# EAGLE design Hip Bass Drum (EAGLE 7.1.0)
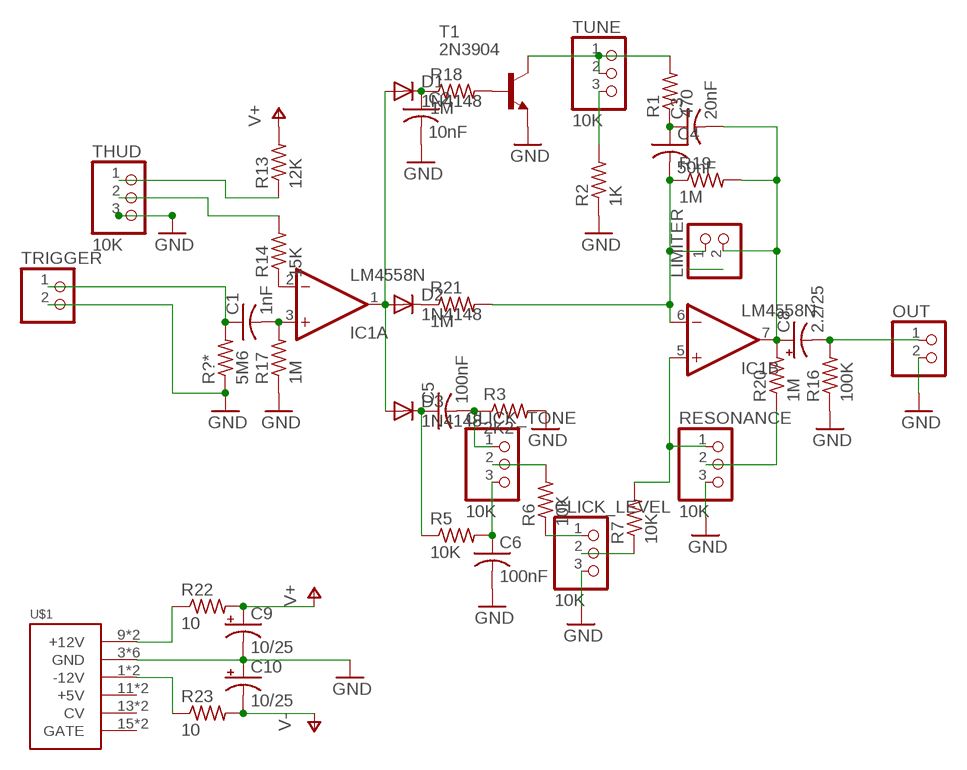
[diagram p0: schematic, sheet 1]

## Parts
C1  1nF  C-US025-030X050  [C025-030X050]
C2  10nF  C-US025-030X050  [C025-030X050]
C3  20nF  C-US025-030X050  [C025-030X050]
C4  50nF  C-US025-030X050  [C025-030X050]
C5  100nF  C-US025-030X050  [C025-030X050]
C6  100nF  C-US025-030X050  [C025-030X050]
C8  2.2/25  CPOL-USE2.5-7  [E2,5-7]
C9  10/25  CPOL-USE2.5-7  [E2,5-7]
C10  10/25  CPOL-USE2.5-7  [E2,5-7]
CLICK_LEVEL  10K  PINHD-1X3  [1X03]
CLICK_TONE  10K  PINHD-1X3  [1X03]
D1  1N4148  [DO35-10]
D2  1N4148  [DO35-10]
D3  1N4148  [DO35-10]
IC1  LM4558N  [DIL08]
LIMITER  PINHD-1X2  [1X02]
OUT  PINHD-1X2  [1X02]
R1  470  R-US_0207/10  [0207/10]
R2  1K  R-US_0207/10  [0207/10]
R3  2K2  R-US_0207/10  [0207/10]
R5  10K  R-US_0207/10  [0207/10]
R6  10K  R-US_0207/10  [0207/10]
R7  10K  R-US_0207/10  [0207/10]
R13  12K  R-US_0207/10  [0207/10]
R14  15K  R-US_0207/10  [0207/10]
R16  100K  R-US_0207/10  [0207/10]
R17  1M  R-US_0207/10  [0207/10]
R18  1M  R-US_0207/10  [0207/10]
R19  1M  R-US_0207/10  [0207/10]
R20  1M  R-US_0207/10  [0207/10]
R21  1M  R-US_0207/10  [0207/10]
R22  10  R-US_0207/10  [0207/10]
R23  10  R-US_0207/10  [0207/10]
R?*  5M6  R-US_0207/10  [0207/10]
RESONANCE  10K  PINHD-1X3  [1X03]
T1  2N3904  [TO92]
THUD  10K  PINHD-1X3  [1X03]
TRIGGER  PINHD-1X2  [1X02]
TUNE  10K  PINHD-1X3  [1X03]
U$1  POWER  [POWER_16]

## Nets
GND: C2.2 C6.2 C9.- C10.+ CLICK_LEVEL.3 OUT.2 R2.1 R3.2 R16.1 R17.1 R?*.1 RESONANCE.3 T1.3(E) THUD.3 TRIGGER.2 U$1.3(GND) U$1.4(GND) U$1.5(GND) U$1.6(GND) U$1.7(GND) U$1.8(GND)
N$1: C1.2 IC1.3(A:+IN) R17.2
N$2: C1.1 R?*.2 TRIGGER.1
N$3: IC1.2(A:-IN) R14.1
N$4: R22.1 U$1.9(+12V) U$1.10(+12V)
N$5: R23.1 U$1.1(-12V) U$1.2(-12V)
N$6: R13.1 THUD.1
N$7: R14.2 THUD.2
N$8: C2.1 D1.C R18.1
N$9: R18.2 T1.2(B)
N$10: D1.A D2.A D3.A IC1.1(A:OUT)
N$11: R1.2 T1.1(C) TUNE.1 TUNE.2
N$12: R2.2 TUNE.3
N$13: C3.1 C4.1 R1.1
N$14: C4.2 IC1.6(B:-IN) LIMITER.1 R19.1 R21.2
N$15: C3.2 C8.+ IC1.7(B:OUT) LIMITER.2 R19.2 R20.2
N$16: D2.C R21.1
N$17: C8.- OUT.1 R16.2
N$18: IC1.5(B:+IN) R7.2 RESONANCE.1
N$19: R20.1 RESONANCE.2
N$20: C5.1 D3.C R5.1
N$21: C6.1 CLICK_TONE.3 R5.2
N$22: C5.2 CLICK_TONE.1 R3.1
N$23: CLICK_TONE.2 R6.2
N$24: CLICK_LEVEL.1 R6.1
N$25: CLICK_LEVEL.2 R7.1
V+: C9.+ R13.2 R22.2
V-: C10.- R23.2
Unconnected: U$1.11(+5V) U$1.12(+5V) U$1.13(CV) U$1.14(CV) U$1.15(GATE) U$1.16(GATE)

## Power pins joined to a net without a drawn wire
V+: IC1.8(P:V+)
V-: IC1.4(P:V-)

## Library data of the parts
C1-C6 = rcl:C-US: CAPACITOR, American symbol
C8-C10 = rcl:CPOL-US: POLARIZED CAPACITOR, American symbol
CLICK_LEVEL CLICK_TONE RESONANCE THUD TUNE = pinhead:PINHD-1X3: PIN HEADER
D1-D3 = diode:1N4148: DIODE high speed (Philips)
IC1 = linear:*4558: OP AMP
LIMITER OUT TRIGGER = pinhead:PINHD-1X2: PIN HEADER
R1-R3 R5-R7 R13 R14 R16-R23 R?* = rcl:R-US_: RESISTOR, American symbol
T1 = transistor:2N3904: NPN TRANSISTOR
U$1 = eurorack:POWER

## Net classes
0 default: clearance 0.205 mm

## Board
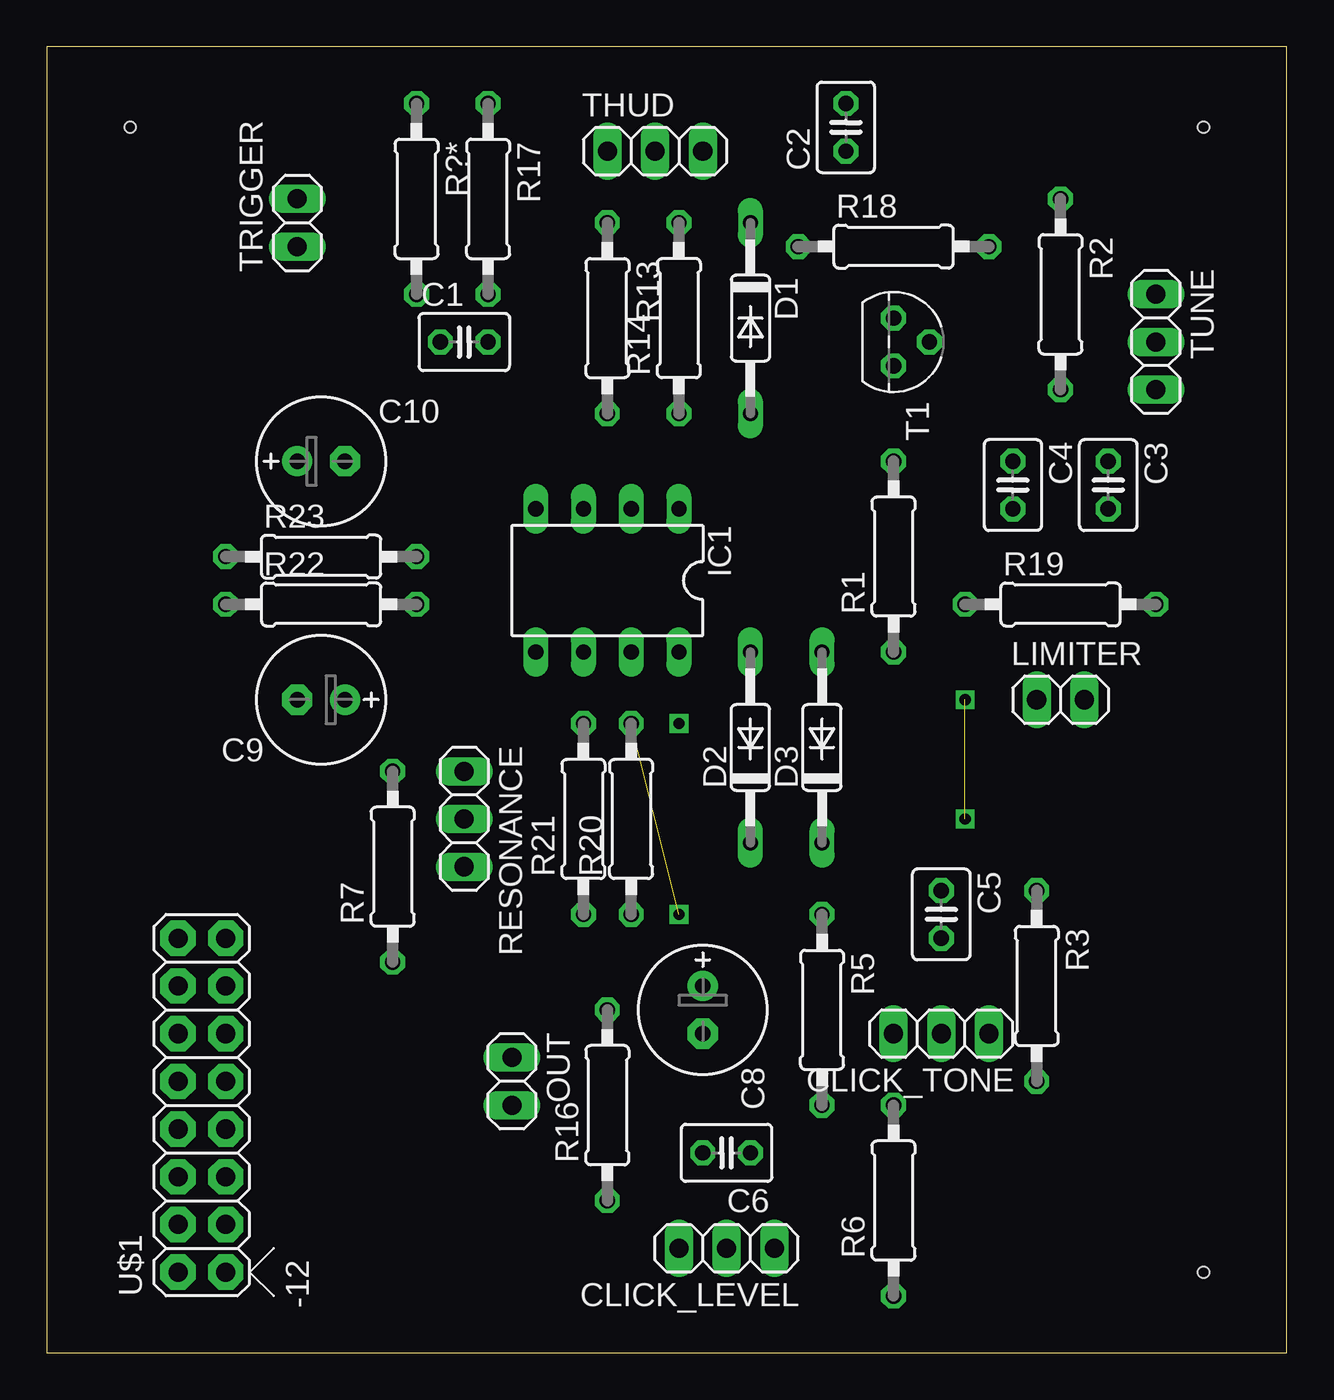
[diagram p1: board, top side]
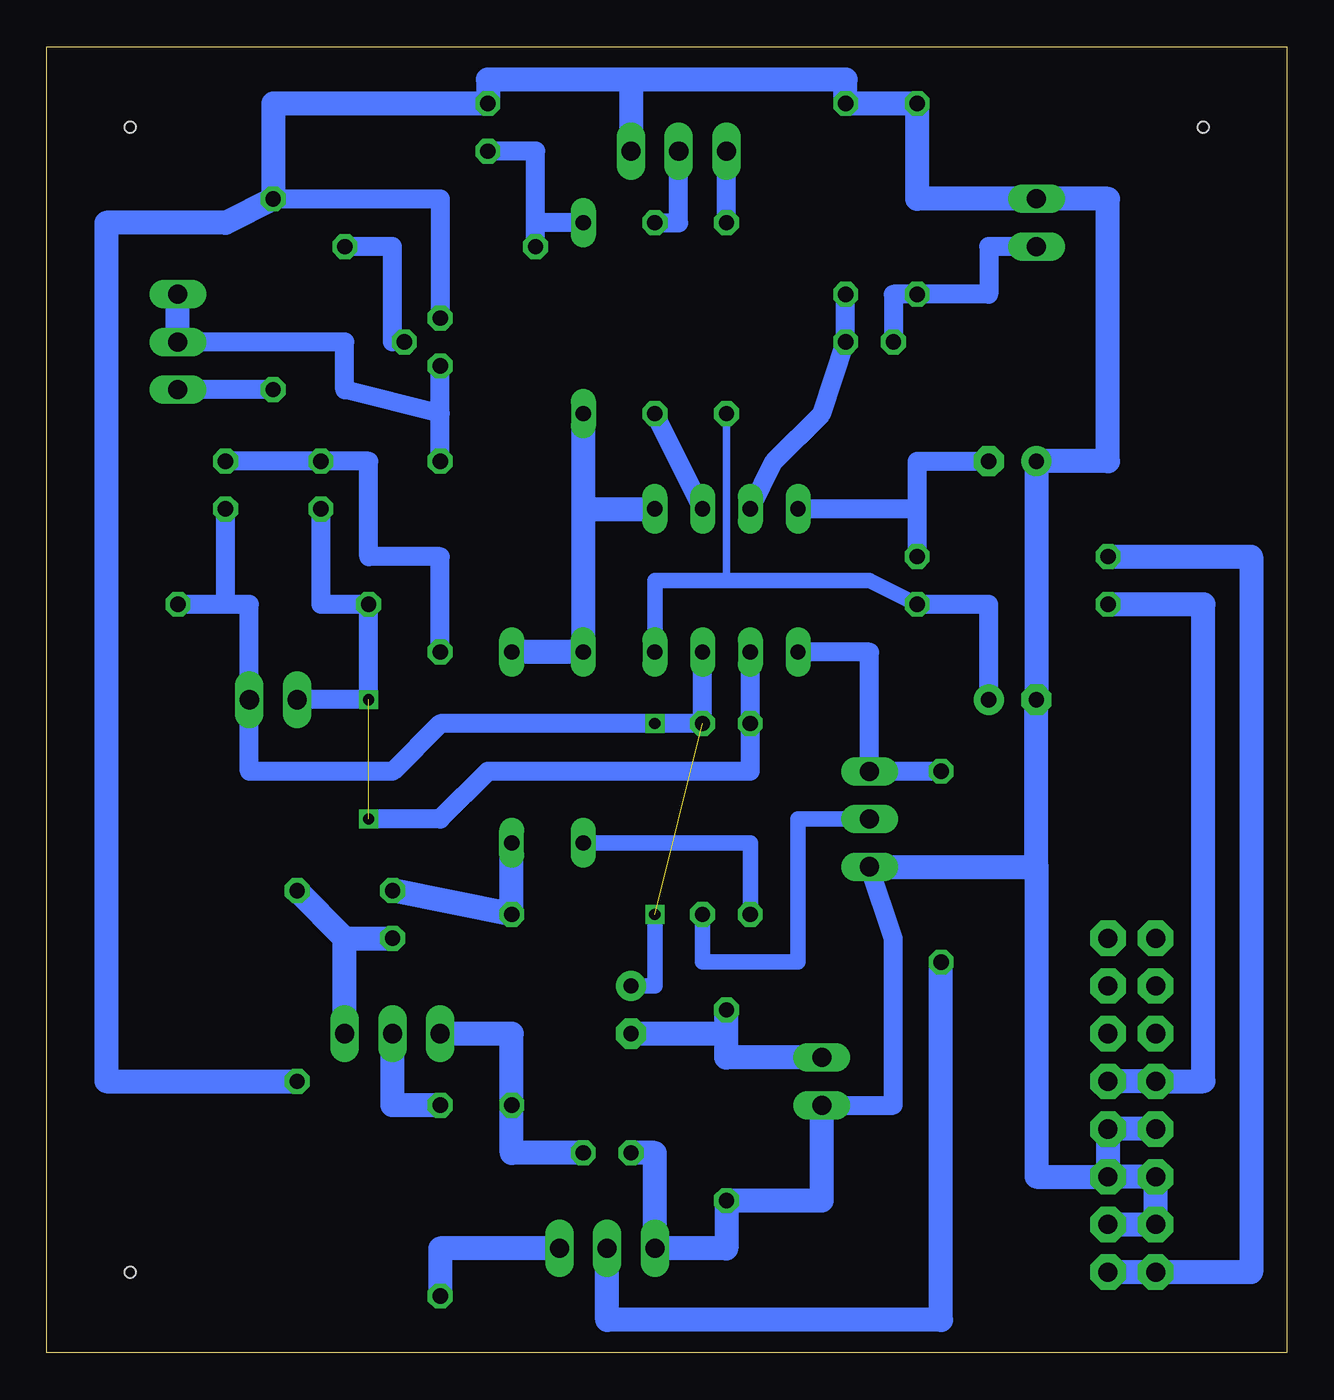
[diagram p2: board, bottom side, seen from below]

Size 66.02 x 69.52 mm. Coordinates in mm from the lower left corner, seen from the top.
Outline: 0,0 66.02,0 66.02,69.52 0,69.52 0,0
Copper layers (1*16): Top 0.035mm / dielectric 1.5mm / Bottom 0.035mm
Design rules "default": minimum track width 10mil, minimum drill 24mil, track to track 8mil, track to pad 8mil, pad to pad 8mil, via to via 8mil, smd to smd 8mil, copper to edge 40mil, drill to drill 8mil, minimum pad ring 10mil, minimum via ring 8mil, stop-mask expansion 4mil, vias tented up to drill 0mil, thermal gap 10mil
Holes 0.6 mm at 4.44,65.24 61.59,65.24 61.59,4.28

### Footprints (pad centres in the part's own frame; a part is rotated, then mirrored left to right if it is on the bottom)
C025-030X050 = drill 0.813 octagon: 1 -1.27,0; 2 1.27,0
E2,5-7 = drill 0.813 pad 1.6: + -1.27,0 | drill 0.813 pad 1.6 octagon: - 1.27,0
1X03 = drill 1.016 long: 1 -2.54,0; 2 0,0; 3 2.54,0
DO35-10 = drill 0.813 long: A 5.08,0; C -5.08,0
DIL08 = drill 0.813 long: 1 -3.81,-3.81; 2 -1.27,-3.81; 3 1.27,-3.81; 4 3.81,-3.81; 5 3.81,3.81; 6 1.27,3.81; 7 -1.27,3.81; 8 -3.81,3.81
1X02 = drill 1.016 long: 1 -1.27,0; 2 1.27,0
0207/10 = drill 0.813 octagon: 1 -5.08,0; 2 5.08,0
TO92 = drill 0.813 octagon: 1 1.27,0; 2 0,1.905; 3 -1.27,0
POWER_16 = drill 1.016 pad 1.88 octagon: 1 -6.35,-1.27; 2 -6.35,1.27; 3 -3.81,-1.27; 4 -3.81,1.27; 5 -1.27,-1.27; 6 -1.27,1.27; 7 1.27,-1.27; 8 1.27,1.27; 9 3.81,-1.27; 10 3.81,1.27; 11 6.35,-1.27; 12 6.35,1.27; 13 8.89,-1.27; 14 8.89,1.27; 15 11.43,-1.27; 16 11.43,1.27

### Placement (x,y rotation side)
C1  22.22,53.81 0 top
C2  42.54,65.24 90 top
C3  56.51,46.19 270 top
C4  51.43,46.19 270 top
C5  47.62,23.33 270 top
C6  36.19,10.63 180 top
C8  34.92,18.25 270 top
C9  14.6,34.76 180 top
C10  14.6,47.46 0 top
CLICK_LEVEL  36.19,5.55 180 top
CLICK_TONE  47.62,16.98 180 top
D1  37.46,55.08 270 top
D2  37.46,32.22 90 top
D3  41.27,32.22 90 top
IC1  29.84,41.11 180 top
LIMITER  53.97,34.76 0 top
OUT  24.76,14.44 270 top
R1  45.08,42.38 90 top
R2  53.97,56.35 270 top
R3  52.7,19.52 270 top
R5  41.27,18.25 270 top
R6  45.08,8.09 90 top
R7  18.41,25.87 90 top
R13  29.84,55.08 270 top
R14  33.65,55.08 90 top
R16  29.84,13.17 90 top
R17  23.49,61.43 270 top
R18  45.08,58.89 0 top
R19  53.97,39.84 0 top
R20  31.11,28.41 90 top
R21  28.57,28.41 90 top
R22  14.6,39.84 0 top
R23  14.6,42.38 0 top
R?*  19.68,61.43 270 top
RESONANCE  22.22,28.41 270 top
T1  45.08,53.81 270 top
THUD  32.38,63.97 0 top
TRIGGER  13.33,60.16 90 top
TUNE  59.05,53.81 270 top
U$1  8.25,10.63 90 top

### Tracks (layer width: path | path; a pad name or v marks a point on that pad's centre or on a via)
GND
  Bottom 1.016: R2.1 45.08,61.43 T1.3 | RESONANCE.3 20.95,22.06 20.95,13.17 OUT.2
  Bottom 1.27: 34.92,67.78 23.49,67.78 R17.1 R?*.1 19.68,61.43 TRIGGER.2 9.52,61.43 9.52,47.46 C10.+ C9.- 13.33,25.87 | 34.92,67.78 42.54,67.78 C2.2 53.97,66.51 R2.1 56.51,60.16 62.86,60.16 62.86,14.44 R3.2 | 34.92,67.78 THUD.3 | RESONANCE.3 13.33,25.87 | OUT.2 24.76,8.09 R16.1 29.84,5.55 CLICK_LEVEL.3 33.65,10.63 C6.2 | 13.33,25.87 13.33,9.36 U$1.5 | U$1.8 U$1.7 U$1.5 | U$1.5 U$1.6 U$1.4 U$1.3
N$1
  Bottom 1.016: R17.2 C1.2 24.76,50 27.3,47.46 IC1.3
N$2
  Bottom 1.016: TRIGGER.1 15.87,58.89 15.87,56.35 R?*.2 20.95,56.35 C1.1
N$3
  Bottom 1.016: IC1.2 R14.1
N$4
  Bottom 1.27: R22.1 4.44,39.84 4.44,14.44 U$1.10 U$1.9
N$5
  Bottom 1.27: R23.1 1.9,42.38 1.9,4.28 U$1.2 U$1.1
N$6
  Bottom 1.016: R13.1 THUD.1
N$7
  Bottom 1.016: R14.2 32.38,60.16 THUD.2
N$8
  Bottom 0.406: 40,60.16 R18.1
  Bottom 1.016: D1.C 40,60.16 | R18.1 40,63.97 C2.1
N$9
  Bottom 0.406: T1.2 47.62,53.81
  Bottom 1.016: 47.62,53.81 47.62,58.89 R18.2
N$10
  Bottom 1.27: 37.46,44.92 D1.A | 37.46,44.92 IC1.1 | 37.46,44.92 D2.A D3.A
N$11
  Bottom 1.016: TUNE.2 50.16,53.81 50.16,51.27 45.08,50 | 45.08,50 T1.1 | R1.2 45.08,50
  Bottom 1.27: TUNE.2 TUNE.1
N$12
  Bottom 1.016: R2.2 TUNE.3
N$13
  Bottom 1.016: R1.1 45.08,42.38 48.89,42.38 48.89,47.46 C4.1 C3.1
N$14  (via drill 0.6)  (1 unrouted)
  Bottom 0.406: IC1.6 R21.2
  Bottom 1.016: C4.2 51.43,39.84 R19.1 v48.89,34.76 LIMITER.1 | IC1.6 28.57,30.95 42.54,30.95 45.08,28.41 48.89,28.41
N$15  (1 unrouted)
  Bottom 0.406: R19.2 56.51,39.84
  Bottom 0.813: C8.+ 33.65,19.52 33.65,23.33
  Bottom 1.016: IC1.7 R20.2 45.08,33.49 47.62,30.95 55.24,30.95 LIMITER.2 55.24,39.84 R19.2 | 56.51,39.84 C3.2
N$16
  Bottom 0.813: R21.1 28.57,27.14 D2.C
N$17
  Bottom 1.27: OUT.1 29.84,15.71 29.84,16.98 | 29.84,16.98 R16.2 | 29.84,16.98 C8.-
N$18
  Bottom 1.016: IC1.5 22.22,37.3 RESONANCE.1 R7.2
N$19
  Bottom 0.813: R20.1 31.11,20.79 26.03,20.79 26.03,28.41 RESONANCE.2
N$20
  Bottom 1.27: D3.C R5.1 C5.1
N$21
  Bottom 1.27: CLICK_TONE.3 41.27,16.98 R5.2 41.27,10.63 C6.1
N$22
  Bottom 1.27: 50.16,22.06 C5.2 | 50.16,22.06 R3.1 | CLICK_TONE.1 50.16,22.06
N$23
  Bottom 1.27: CLICK_TONE.2 47.62,13.17 R6.2
N$24
  Bottom 1.27: CLICK_LEVEL.1 45.08,5.55 R6.1
N$25
  Bottom 1.27: R7.1 18.41,1.74 36.19,1.74 CLICK_LEVEL.2
N$26  (via drill 0.6)
  other vias: 33.65,33.49
N$27  (via drill 0.6)
  other vias: 33.65,23.33
N$28  (via drill 0.6)
  other vias: 48.89,28.41
V+
  Bottom 0.406: 29.84,41.11 R13.2
  Bottom 0.813: R22.2 22.22,41.11 29.84,41.11 33.65,41.11 IC1.8
  Bottom 1.016: R22.2 15.87,39.84 C9.+
V-
  Bottom 1.016: C10.- 19.68,47.46 19.68,44.92 | R23.2 19.68,44.92 | 19.68,44.92 IC1.4